# EAGLE board 50_Shot_Relay_V0.0 (EAGLE 7.6.0)
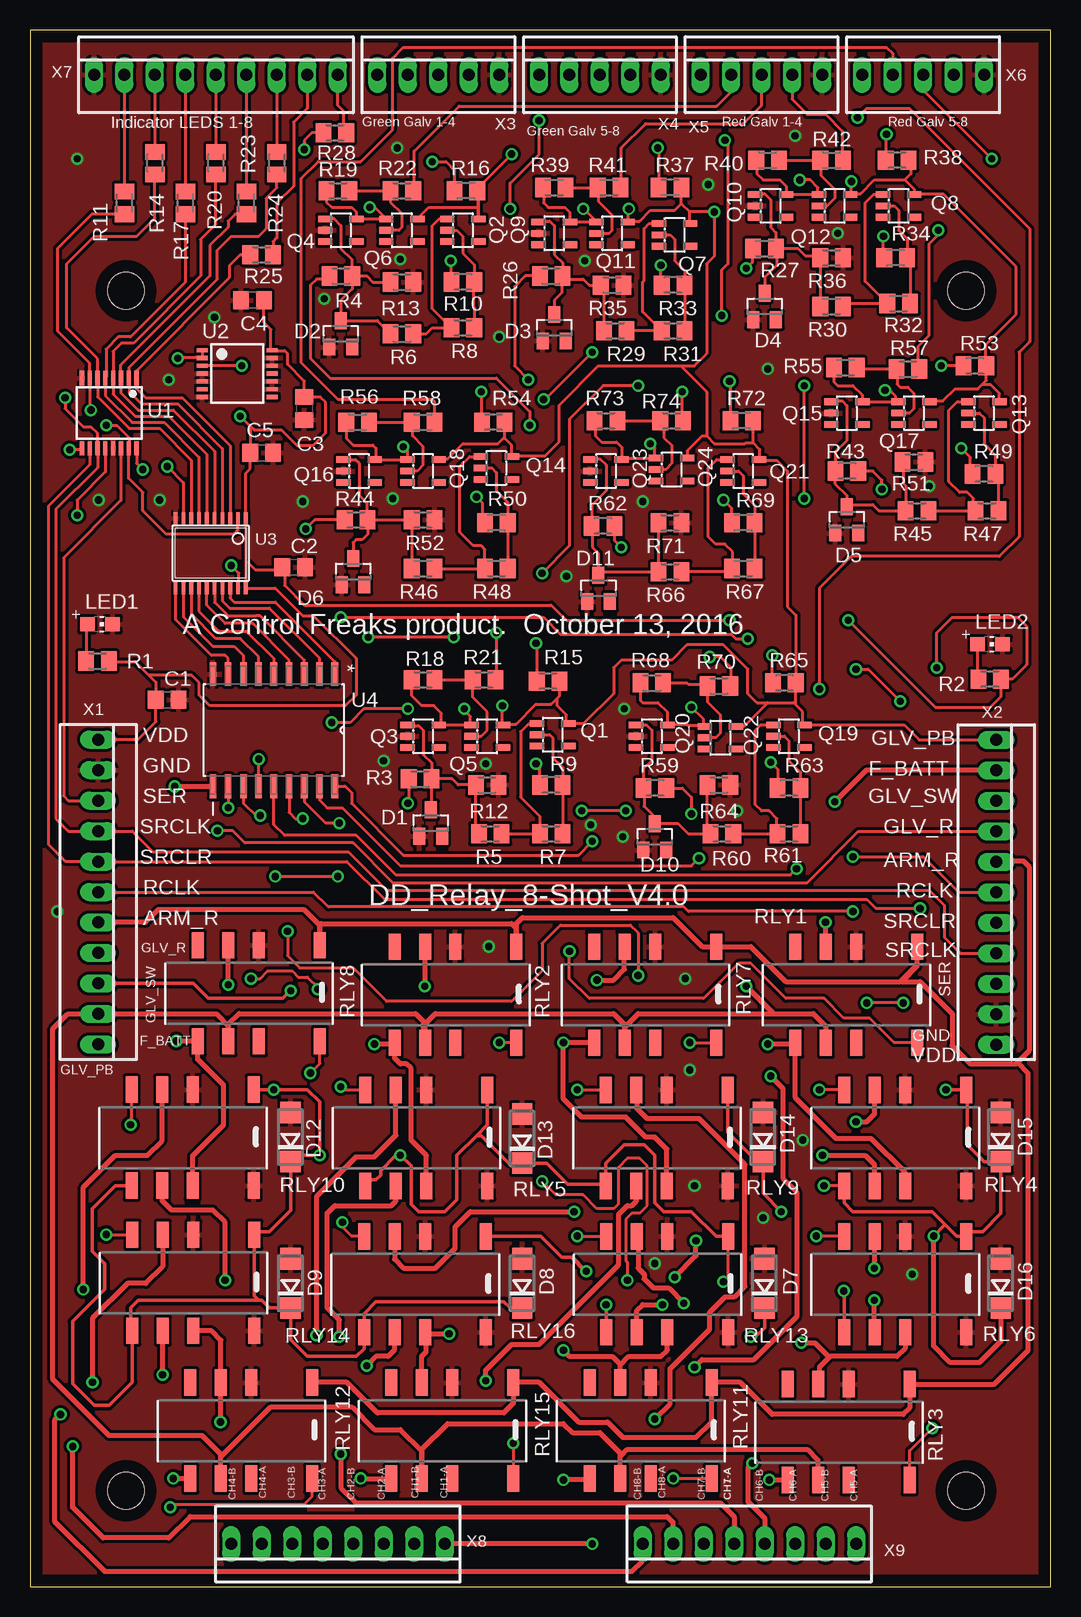
[diagram p2: board, top side]
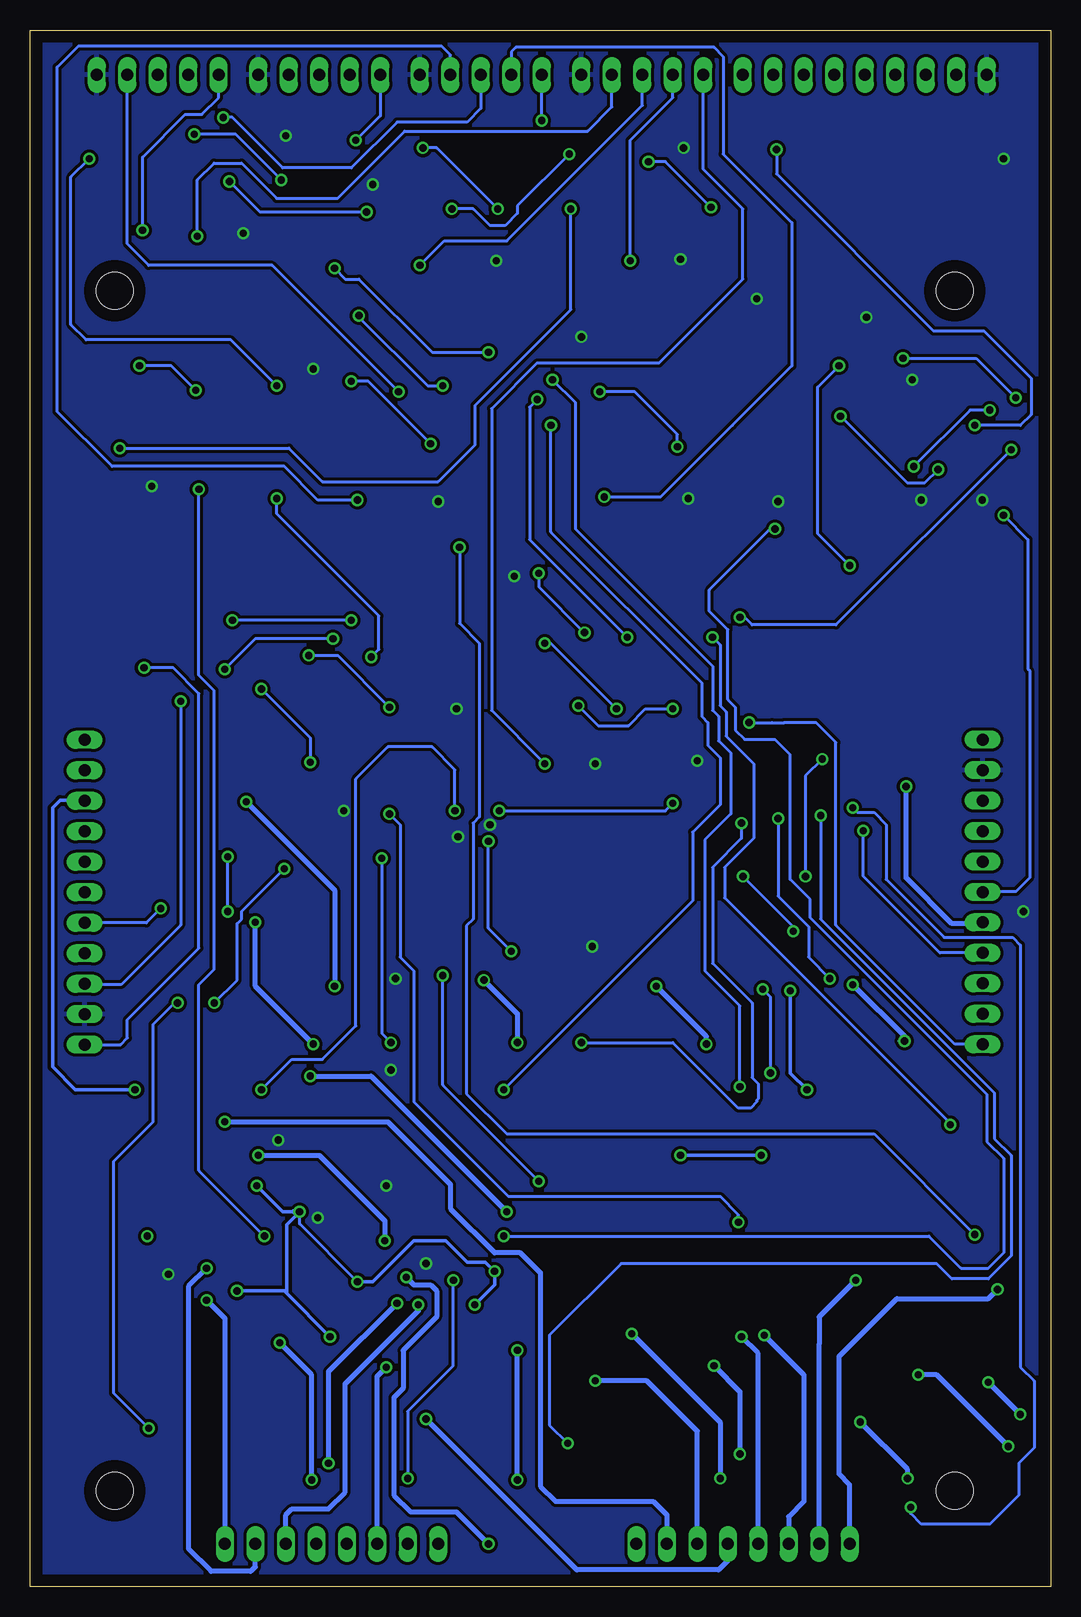
[diagram p3: board, bottom side, seen from below]

Size 85.07 x 129.72 mm. Coordinates in mm from the lower left corner, seen from the top.
Outline: 0,0 85.07,0 85.07,129.72 0,129.72 0,0
Copper layers (1*16): Top 0.035mm / dielectric 1.5mm / Bottom 0.035mm
Design rules "default *": minimum track width 10mil, minimum drill 20mil, track to track 10mil, track to pad 10mil, pad to pad 10mil, via to via 10mil, smd to smd 8mil, copper to edge 40mil, drill to drill 8mil, minimum pad ring 10mil, minimum via ring 8mil, stop-mask expansion 4mil, vias tented up to drill 0mil, thermal gap 10mil
Net classes: 0 default: width 0.254 mm, drill 0.508 mm, clearance 0.254 mm
Holes 3.05 mm at 8,108 8,8 78,8 78,108

## Footprints (pad centres in the part's own frame; a part is rotated, then mirrored left to right if it is on the bottom)
C0805 = smd 1.3 x 1.5: 1 -0.95,0; 2 0.95,0
SOT23 = smd 1 x 1.4: 1 -0.95,-1.1; 2 0.95,-1.1; 3 0,1.1
DO214AC = smd 1.8 x 1.7: A 2.05,0; C -2.05,0
CHIP-LED0805 = smd 1.2 x 1.2: A 0,-1.05; C 0,1.05
SOT23-5L = smd 0.55 x 1.2: 1 -0.95,-1.3; 2 0,-1.3; 3 0.95,-1.3; 4 0.95,1.3; 5 -0.95,1.3
M0805 = smd 1.3 x 1.6: 1 -0.95,0; 2 0.95,0
OMRONG6S = smd 1 x 2.2: 1 -3.2,-5.825; 2 1.88,-5.825; 3 4.42,-5.825; 4 6.96,-5.825; 5 6.96,2.175; 6 4.42,2.175; 7 1.88,2.175; 8 -3.2,2.175
TSSOP16 = smd 0.35 x 1.2: 1 -2.275,-2.925; 2 -1.625,-2.925; 3 -0.975,-2.925; 4 -0.325,-2.925; 5 0.325,-2.925; 6 0.975,-2.925; 7 1.625,-2.925; 8 2.275,-2.925; 9 2.275,2.925; 10 1.625,2.925; 11 0.975,2.925; 12 0.325,2.925; 13 -0.325,2.925; 14 -0.975,2.925; 15 -1.625,2.925; 16 -2.275,2.925
TSSOP14 = smd 0.35 x 0.9: 1 -1.95,-2.925; 2 -1.3,-2.925; 3 -0.65,-2.925; 4 0,-2.925; 5 0.65,-2.925; 6 1.3,-2.925; 7 1.95,-2.925; 8 1.95,2.925; 9 1.3,2.925; 10 0.65,2.925; 11 0,2.925; 12 -0.65,2.925; 13 -1.3,2.925; 14 -1.95,2.925
TSSOP20 = smd 0.305 x 0.991: 1 -2.997,-2.935; 2 -2.347,-2.935; 3 -1.697,-2.935; 4 -1.047,-2.935; 5 -0.397,-2.935; 6 0.253,-2.935; 7 0.903,-2.935; 8 1.553,-2.935; 9 2.203,-2.935; 10 2.853,-2.935; 11 2.853,2.901; 12 2.203,2.901; 13 1.553,2.901; 14 0.903,2.901; 15 0.253,2.901; 16 -0.397,2.901; 17 -1.047,2.901; 18 -1.697,2.901; 19 -2.347,2.901; 20 -2.997,2.901
SOIC127P1030X265-18N = smd 1.981 x 0.559: 1 -4.674,5.08; 2 -4.674,3.81; 3 -4.674,2.54; 4 -4.674,1.27; 5 -4.674,0; 6 -4.674,-1.27; 7 -4.674,-2.54; 8 -4.674,-3.81; 9 -4.674,-5.08; 10 4.674,-5.08; 11 4.674,-3.81; 12 4.674,-2.54; 13 4.674,-1.27; 14 4.674,0; 15 4.674,1.27; 16 4.674,2.54; 17 4.674,3.81; 18 4.674,5.08
22-23-2111 = drill 1 long: 1 -12.7,0; 2 -10.16,0; 3 -7.62,0; 4 -5.08,0; 5 -2.54,0; 6 0,0; 7 2.54,0; 8 5.08,0; 9 7.62,0; 10 10.16,0; 11 12.7,0
22-23-2051 = drill 1 long: 1 -5.08,0; 2 -2.54,0; 3 0,0; 4 2.54,0; 5 5.08,0
22-23-2091 = drill 1 long: 1 -10.16,0; 2 -7.62,0; 3 -5.08,0; 4 -2.54,0; 5 0,0; 6 2.54,0; 7 5.08,0; 8 7.62,0; 9 10.16,0
22-23-2081 = drill 1 long: 1 -8.89,0; 2 -6.35,0; 3 -3.81,0; 4 -1.27,0; 5 1.27,0; 6 3.81,0; 7 6.35,0; 8 8.89,0

## Placement (x,y rotation side)
C1  0.01uF  [C0805]  11.43,73.91 0 top
C2  0.01uF  [C0805]  21.97,84.96 0 top
C3  0.01uF  [C0805]  22.86,98.17 270 top
C4  0.01uF  [C0805]  18.54,107.19 180 top
C5  0.01uF  [C0805]  19.3,94.49 0 top
D1  5.0V  [SOT23]  33.4,63.63 0 top
D2  5.0V  [SOT23]  25.91,104.39 0 top
D3  5.0V  [SOT23]  43.69,104.9 0 top
D4  5.0V  [SOT23]  61.21,106.68 0 top
D5  5.0V  [SOT23]  68.07,88.9 0 top
D6  5.0V  [SOT23]  26.92,84.58 0 top
D7  SA2M-E3/5ATGICT-ND  [DO214AC]  61.21,25.27 90 top
D8  SA2M-E3/5ATGICT-ND  [DO214AC]  41.02,25.27 90 top
D9  SA2M-E3/5ATGICT-ND  [DO214AC]  21.72,25.27 90 top
D10  5.0V  [SOT23]  52.07,62.48 0 top
D11  5.0V  [SOT23]  47.37,83.19 0 top
D12  SA2M-E3/5ATGICT-ND  [DO214AC]  21.72,37.47 90 top
D13  SA2M-E3/5ATGICT-ND  [DO214AC]  41.02,37.34 90 top
D14  SA2M-E3/5ATGICT-ND  [DO214AC]  61.09,37.47 90 top
D15  SA2M-E3/5ATGICT-ND  [DO214AC]  80.9,37.47 90 top
D16  SA2M-E3/5ATGICT-ND  [DO214AC]  80.9,25.27 90 top
LED1  LEDCHIP-LED0805  [CHIP-LED0805]  5.83,80.2 270 top
LED2  LEDCHIP-LED0805  [CHIP-LED0805]  80,78.53 270 top
Q1  Qs5U34CT-ND  [SOT23-5L]  43.56,70.99 270 top
Q2  Qs5U34CT-ND  [SOT23-5L]  36.07,113.03 270 top
Q3  Qs5U34CT-ND  [SOT23-5L]  32.77,70.87 270 top
Q4  Qs5U34CT-ND  [SOT23-5L]  25.91,113.03 270 top
Q5  Qs5U34CT-ND  [SOT23-5L]  38.1,70.87 270 top
Q6  Qs5U34CT-ND  [SOT23-5L]  30.99,113.03 270 top
Q7  Qs5U34CT-ND  [SOT23-5L]  53.72,112.65 270 top
Q8  Qs5U34CT-ND  [SOT23-5L]  72.39,115.06 270 top
Q9  Qs5U34CT-ND  [SOT23-5L]  43.69,112.78 270 top
Q10  Qs5U34CT-ND  [SOT23-5L]  61.72,115.06 270 top
Q11  Qs5U34CT-ND  [SOT23-5L]  48.51,112.78 270 top
Q12  Qs5U34CT-ND  [SOT23-5L]  67.06,115.06 270 top
Q13  Qs5U34CT-ND  [SOT23-5L]  79.5,97.79 270 top
Q14  Qs5U34CT-ND  [SOT23-5L]  38.86,93.22 270 top
Q15  Qs5U34CT-ND  [SOT23-5L]  68.07,97.79 270 top
Q16  Qs5U34CT-ND  [SOT23-5L]  27.43,92.96 270 top
Q17  Qs5U34CT-ND  [SOT23-5L]  73.66,97.79 270 top
Q18  Qs5U34CT-ND  [SOT23-5L]  32.77,92.96 270 top
Q19  Qs5U34CT-ND  [SOT23-5L]  63.25,70.87 270 top
Q20  Qs5U34CT-ND  [SOT23-5L]  51.82,70.87 270 top
Q21  Qs5U34CT-ND  [SOT23-5L]  59.44,92.96 270 top
Q22  Qs5U34CT-ND  [SOT23-5L]  57.53,70.74 270 top
Q23  Qs5U34CT-ND  [SOT23-5L]  48.01,92.96 270 top
Q24  Qs5U34CT-ND  [SOT23-5L]  53.47,93.09 270 top
R1  100  [M0805]  5.62,77.14 180 top
R2  100  [M0805]  79.98,75.62 0 top
R3  10k  [M0805]  32.51,67.31 180 top
R4  10k  [M0805]  25.91,109.22 180 top
R5  100k  [M0805]  38.35,62.74 180 top
R6  100k  [M0805]  30.99,104.39 180 top
R7  1M  [M0805]  43.43,62.74 180 top
R8  1M  [M0805]  36.07,104.9 180 top
R9  1k  [M0805]  43.43,66.8 0 top
R10  1k  [M0805]  36.07,108.71 0 top
R11  330  [M0805]  7.87,115.32 270 top
R12  100k  [M0805]  38.1,66.8 180 top
R13  100k  [M0805]  30.99,108.71 180 top
R14  330  [M0805]  10.41,118.62 270 top
R15  10k  [M0805]  43.18,75.44 0 top
R16  10k  [M0805]  36.32,116.33 0 top
R17  330  [M0805]  12.95,115.32 270 top
R18  100k  [M0805]  32.77,75.56 180 top
R19  100k  [M0805]  25.65,116.33 180 top
R20  330  [M0805]  15.49,118.62 270 top
R21  1k  [M0805]  37.85,75.56 180 top
R22  1k  [M0805]  30.99,116.33 180 top
R23  330  [M0805]  18.03,115.32 270 top
R24  330  [M0805]  20.57,118.62 270 top
R25  330  [M0805]  19.3,111 180 top
R26  10k  [M0805]  43.43,109.22 180 top
R27  10k  [M0805]  61.21,111.51 180 top
R28  330  [M0805]  25.4,121.16 180 top
R29  100k  [M0805]  48.77,104.65 180 top
R30  100k  [M0805]  66.8,106.68 180 top
R31  1M  [M0805]  53.59,104.65 180 top
R32  1M  [M0805]  72.39,106.93 180 top
R33  1k  [M0805]  53.59,108.46 0 top
R34  1k  [M0805]  72.14,110.74 0 top
R35  100k  [M0805]  48.51,108.46 180 top
R36  100k  [M0805]  66.8,110.74 180 top
R37  10k  [M0805]  53.34,116.59 0 top
R38  10k  [M0805]  72.26,118.87 0 top
R39  100k  [M0805]  43.69,116.59 180 top
R40  100k  [M0805]  61.47,118.87 180 top
R41  1k  [M0805]  48.26,116.59 180 top
R42  1k  [M0805]  66.8,118.87 180 top
R43  10k  [M0805]  68.07,92.96 0 top
R44  10k  [M0805]  27.18,88.9 180 top
R45  100k  [M0805]  73.91,89.66 180 top
R46  100k  [M0805]  32.77,84.84 180 top
R47  1M  [M0805]  79.76,89.66 180 top
R48  1M  [M0805]  38.86,84.84 180 top
R49  1k  [M0805]  79.5,92.71 0 top
R50  1k  [M0805]  38.86,88.65 0 top
R51  100k  [M0805]  73.66,93.73 180 top
R52  100k  [M0805]  32.77,88.9 180 top
R53  10k  [M0805]  78.74,101.73 0 top
R54  10k  [M0805]  38.61,97.03 0 top
R55  100k  [M0805]  67.94,101.6 180 top
R56  100k  [M0805]  27.3,97.03 180 top
R57  1k  [M0805]  73.15,101.47 180 top
R58  1k  [M0805]  32.77,97.03 180 top
R59  10k  [M0805]  52.07,66.55 0 top
R60  100k  [M0805]  57.66,62.74 180 top
R61  1M  [M0805]  63.25,62.74 180 top
R62  10k  [M0805]  47.75,88.39 0 top
R63  1k  [M0805]  63.25,66.55 0 top
R64  100k  [M0805]  57.4,66.8 180 top
R65  10k  [M0805]  62.87,75.31 0 top
R66  100k  [M0805]  53.34,84.58 180 top
R67  1M  [M0805]  59.44,84.84 180 top
R68  100k  [M0805]  51.82,75.31 180 top
R69  1k  [M0805]  59.44,88.65 0 top
R70  1k  [M0805]  57.4,75.06 180 top
R71  100k  [M0805]  53.34,88.65 180 top
R72  10k  [M0805]  59.31,97.16 0 top
R73  100k  [M0805]  48.01,97.16 180 top
R74  1k  [M0805]  53.47,97.16 180 top
RLY1  OMRON  [OMRONG6S]  70.74,47.5 180 top
RLY2  OMRON  [OMRONG6S]  37.34,47.5 180 top
RLY3  OMRON  [OMRONG6S]  70.1,11.05 180 top
RLY4  OMRON  [OMRONG6S]  74.8,35.56 180 top
RLY5  OMRON  [OMRONG6S]  34.91,35.56 180 top
RLY6  OMRON  [OMRONG6S]  74.8,23.37 180 top
RLY7  OMRON  [OMRONG6S]  53.98,47.5 180 top
RLY8  OMRON  [OMRONG6S]  20.95,47.62 180 top
RLY9  OMRON  [OMRONG6S]  54.95,35.56 180 top
RLY10  OMRON  [OMRONG6S]  15.43,35.59 180 top
RLY11  OMRON  [OMRONG6S]  53.59,11.18 180 top
RLY12  OMRON  [OMRONG6S]  20.32,11.18 180 top
RLY13  OMRON  [OMRONG6S]  54.99,23.37 180 top
RLY14  OMRON  [OMRONG6S]  15.49,23.5 180 top
RLY15  OMRON  [OMRONG6S]  37.08,11.18 180 top
RLY16  OMRON  [OMRONG6S]  34.8,23.37 180 top
U1  MM74HC595  [TSSOP16]  6.6,97.79 180 top
U2  7400  [TSSOP14]  17.27,101.09 270 top
U3  MM74HC245  [TSSOP20]  14.99,86.11 180 top
U4  ULN2803ADW  [SOIC127P1030X265-18N]  20.32,71.37 270 top
X1  22-23-2111  [22-23-2111]  5.68,57.88 270 top
X2  22-23-2111  [22-23-2111]  80.52,57.86 270 top
X3  22-23-2051  [22-23-2051]  34.04,125.98 0 top
X4  22-23-2051  [22-23-2051]  47.5,125.98 0 top
X5  22-23-2051  [22-23-2051]  60.96,125.98 0 top
X6  22-23-2051  [22-23-2051]  74.42,125.98 0 top
X7  22-23-2091  [22-23-2091]  15.49,125.98 0 top
X8  22-23-2081  [22-23-2081]  25.65,3.56 180 top
X9  22-23-2081  [22-23-2081]  59.94,3.56 180 top

## Tracks (layer width: path | path; a pad name or v marks a point on that pad's centre or on a via)
ARM_RELAY  (via drill 0.6)
  Top 0.254: v12.06,66.67 12.09,66.7
  Top 0.406: 12.09,66.7 U4.10 | 24.13,55.12 24.16,55.09 RLY8.1 24.13,53.48 24.13,55.12 | 24.13,55.12 22.86,56.39 10.67,56.39 9.62,55.34 X1.7 | 40.51,54.86 40.51,55.24 41.02,55.75 53.59,55.75 56.02,53.32 RLY7.1 | 40.51,54.86 40.51,53.35 RLY2.1 40.54,55.02 | 57.15,53.35 RLY7.1 | RLY7.1 57.19,53.34 60.07,53.34 62.99,50.42 72.52,50.42 73.94,51.84 RLY1.1 73.91,53.3 73.91,51.69 72.64,50.42 74.17,50.42 76.83,47.75 76.83,45.09 78.36,43.56 82.17,43.56 82.3,43.69 | 82.3,43.69 83.31,44.7 83.31,59.94 82.8,60.45 80.57,60.45 X2.5 | 82.3,43.69 83.19,42.8 83.19,19.68 80.37,16.87 RLY3.1 73.3,14.88 72.77,14.35 61.85,14.35 59.18,17.02 56.81,17.02 RLY11.1 56.79,13.74 55.5,12.45 49.4,12.45 48.13,13.72 45.72,13.72 42.42,17.02 40.3,17.02 RLY15.1 40.28,15.27 39.5,14.48 28.96,14.48 26.42,17.02 23.54,17.02 RLY12.1 | 24.13,55.12 24.26,55.24 40.13,55.24 40.51,54.86
  Bottom 0.254: X1.7 5.78,55.24
  Bottom 0.406: 5.78,55.24 8.26,55.24 12.06,59.05 v12.06,66.67
CH1_A  (via drill 0.6)
  Top 0.406: v66.04,35.94 69.6,35.94 70.36,35.18 70.36,33.41 RLY4.6 | v46.86,3.56 X8.1 | v53.72,25.78 55.5,27.56 v55.5,28.83
  Bottom 0.406: v46.86,3.56 49.53,6.22 53.34,6.22 54.74,7.62 54.74,15.75 53.98,16.51 53.98,19.68 51.18,22.48 51.18,24.64 51.69,25.15 53.09,25.15 v53.72,25.78 | v66.04,35.94 60.96,35.94 55.5,30.48 v55.5,28.83
CH1_B  (via drill 0.6)
  Top 0.406: v68.83,38.73 69.72,38.73 70.38,39.4 RLY4.3
  Bottom 0.406: X8.2 32,5.97 33.15,7.11 41.27,7.11 42.55,8.38 42.55,26.16 44.2,27.81 46.35,27.81 50.04,31.5 50.04,33.53 55.24,38.73 v68.83,38.73
CH2_A  (via drill 0.6)
  Top 0.406: v37.97,17.14 37.97,18.03 40.13,20.19 42.42,20.19 49.02,26.8 49.02,30.99 49.78,31.75 50.16,31.75 50.53,32.12 RLY9.6
  Bottom 0.406: X8.3 29.46,12.95 33.66,17.14 v37.97,17.14
CH2_B  (via drill 0.6)
  Top 0.406: RLY9.3 50.55,41.37 50.55,39.88 51.44,38.99 55.75,38.99 59.56,35.18 59.56,25.02 58.67,24.13 57.91,24.13 56.64,22.86 56.64,21.46 53.34,18.16 53.34,15.24 v52.07,13.97
  Bottom 0.406: X8.4 26.92,2.16 27.69,1.4 39.5,1.4 v52.07,13.97
CH3_A  (via drill 0.6)
  Top 0.406: v25.78,20.83 25.78,22.23 24.77,23.24 24.77,31.11 25.4,31.75 30.11,31.75 30.49,32.13 RLY5.6
  Bottom 0.406: X8.5 24.38,19.43 v25.78,20.83
CH3_B  (via drill 0.6)
  Top 0.406: v23.88,20.95 23.88,32.51 27.18,35.81 28.7,35.81 30.49,37.61 RLY5.3
  Bottom 0.406: v23.88,20.95 20.57,17.65 20.57,7.11 21.84,5.84 X8.6
CH4_A  (via drill 0.6)
  Top 0.406: RLY10.6 11.01,32.17 11.81,31.37 15.24,31.37 16.26,30.35 v16.26,25.53
  Bottom 0.406: X8.7 19.3,19.43 19.3,20.19 19.3,22.48 v16.26,25.53
CH4_B  (via drill 0.6)
  Top 0.406: v4.45,24.77 4.45,33.27 7.11,35.94 9.78,35.94 11.01,37.17 RLY10.3
  Bottom 0.406: X8.8 16.76,8.51 17.65,9.4 17.65,19.18 12.83,24 5.21,24 v4.45,24.77
CH5_A  (via drill 0.6)
  Top 0.406: RLY6.6 70.36,21.22 v70.36,23.88
  Bottom 0.406: v70.36,23.88 68.83,22.35 X9.1
CH5_B  (via drill 0.6)
  Top 0.406: RLY6.3 70.36,29.17 v70.36,26.54
  Bottom 0.406: v70.36,26.54 71.88,25.02 71.88,3.17 69.98,1.27 66.67,1.27 66.29,1.65 X9.2
CH6_A  (via drill 0.6)
  Top 0.406: 50.55,21.22 RLY13.6 50.57,23.01 51.05,23.5 v52.7,23.5
  Bottom 0.406: X9.3 63.75,5.97 63.25,6.48 60.2,6.48 58.8,7.87 58.8,16.89 52.7,22.99 v52.7,23.5
CH6_B  (via drill 0.6)
  Top 0.406: RLY13.3 50.67,29.09 50.67,26.54 51.18,26.04 51.18,25.65 51.94,24.89 53.21,24.89 v54.48,23.62 | v60.2,10.29 59.82,9.91 59.82,7.11 61.21,5.71 X9.4
  Bottom 0.406: v54.48,23.62 60.2,17.91 v60.2,10.29
CH7_A  (via drill 0.6)
  Top 0.406: RLY16.6 30.35,21.17 30.35,19.68 29.84,19.18 28.83,19.18 v28.07,18.41 | v25.91,11.05 25.91,8.26 27.18,6.99 57.53,6.99 58.67,5.84 X9.5
  Bottom 0.406: v28.07,18.41 25.91,16.26 v25.91,11.05
CH7_B  (via drill 0.6)
  Top 0.406: RLY16.3 30.38,27.28 31.11,26.54 33.78,26.54 35.43,28.19 35.43,29.97 36.7,31.24 v45.34,31.24 | v61.72,42.55 62.74,41.53 62.74,34.04 63.88,32.89 63.88,22.48 60.33,18.92 56.01,18.92 v55.37,18.29
  Bottom 0.406: X9.6 56.13,17.53 v55.37,18.29 | v61.72,42.55 56.64,42.55 v45.34,31.24
CH8_A  (via drill 0.6)
  Top 0.406: X9.7 53.59,5.33 53.09,5.84 13.34,5.84 11.56,4.06 6.1,4.06 3.56,6.6 v3.56,11.68 | v11.05,17.65 11.07,17.68 RLY14.6
  Bottom 0.406: v3.56,11.68 9.53,17.65 v11.05,17.65
CH8_B  (via drill 0.6)
  Top 0.406: RLY14.3 11.05,29.3 11.05,26.67 9.65,25.27 8.13,25.27 5.21,22.35 v5.21,17.02 | v2.54,14.35 2.03,13.84 2.03,5.46 6.22,1.27 50.16,1.27 51.05,2.16 X9.8
  Bottom 0.406: v5.21,17.02 v2.54,14.35
F_BATT  (via drill 0.6)
  Top 0.406: 61.98,47.75 50.67,47.75 49.55,46.63 RLY7.6 49.55,46.84 48.64,47.75 33.78,47.75 32.92,46.89 RLY2.6 32.77,45.48 32.77,47.12 32.13,47.75 17.4,47.75 16.54,46.89 RLY8.6 16.54,46.71 15.52,47.72 X1.10 3.15,47.72 1.91,46.48 1.91,17.27 6.6,12.57 14.35,12.57 15.9,11.02 RLY12.6 15.9,10.82 20.07,14.99 26.8,14.99 28.7,13.08 30.86,13.08 32.64,11.3 32.64,9.03 RLY15.6 32.66,11.46 34.8,13.59 44.45,13.59 45.21,12.83 47.5,12.83 49.15,11.18 49.15,9.03 RLY11.6 49.17,10.82 49.78,11.43 64.77,11.43 65.66,10.54 65.66,8.9 RLY3.6 | 61.98,47.75 65.28,47.75 66.32,46.71 RLY1.6 | X2.2 69.67,68.02 v67.06,65.41 | v59.69,50.04 61.98,47.75
  Bottom 0.406: v67.06,65.41 59.69,58.04 v59.69,50.04
GLV1_GRN  (via drill 0.6)
  Top 0.254: R9.1 42.48,68.26 v42.16,68.58
  Bottom 0.254: v42.16,68.58 46.61,73.03 46.61,98.17 42.8,101.98 32.64,101.98 25.65,108.97 25.65,114.81 28.96,118.11 X3.1
GLV1_RED  (via drill 0.6)
  Top 0.254: v50.67,100.08 47.75,100.08 44.96,97.28 44.96,86.74 v42.67,84.45 | v38.86,79.5 38.86,75.63 R21.1 | v57.91,120.52 58.17,120.27 58.17,110.24 57.66,109.73 v57.66,105.92
  Bottom 0.254: X5.1 55.88,122.56 v57.91,120.52 | v50.67,100.08 51.94,100.08 57.66,105.79 v57.66,105.92 | v42.67,84.45 42.67,83.31 v38.86,79.5
GLV2_GRN  (via drill 0.6)
  Top 0.254: R10.1 35.12,110.42 v35.05,110.49
  Bottom 0.254: v35.05,110.49 35.05,120.52 31.5,124.08 X3.2
GLV2_RED
  Top 0.254: R22.1 32,116.4 32,119.63 35.75,123.38 57.21,123.38 58.42,124.59 X5.2
GLV3_GRN  (via drill 0.6)
  Top 0.254: R33.1 52.58,108.52 v52.58,110.11
  Bottom 0.254: v52.58,110.11 50.55,112.14 45.34,112.14 34.04,123.44 X3.3
GLV3_RED
  Top 0.254: R41.1 49.28,116.65 49.28,119.89 51.31,121.92 59.44,121.92 60.96,123.44 X5.3
GLV4_GRN  (via drill 0.6)
  Top 0.254: R34.1 71.12,110.74 v71.12,112.52
  Bottom 0.254: v71.12,112.52 71.12,117.22 69.72,118.62 67.44,118.62 64.52,115.7 59.44,115.7 53.85,121.28 38.61,121.28 36.58,123.32 X3.4
GLV4_RED
  Top 0.254: X5.4 63.5,123.95 64.77,122.68 66.29,122.68 67.69,121.28 67.69,118.93 R42.1
GLV5_GRN  (via drill 0.6)
  Top 0.254: R49.1 78.36,92.9 78.36,94.11 v77.6,94.87 | v40.01,114.81 40.01,116.97 42.42,119.38 v42.42,122.17
  Bottom 0.254: v40.01,114.81 40.01,106.43 48.01,98.42 48.01,95.12 51.05,92.08 60.71,92.08 63.5,94.87 v77.6,94.87 | v42.42,122.17 X4.1
GLV5_RED  (via drill 0.6)
  Top 0.254: R57.1 74.04,101.53 74.04,103.38 74.93,104.27 74.93,111.89 75.69,112.65 v75.69,113.03
  Bottom 0.254: v75.69,113.03 75.69,119.13 72.14,122.68 70.74,122.68 69.34,124.08 X6.1
GLV6_GRN  (via drill 0.6)
  Top 0.254: R50.1 37.72,88.65 37.72,90.3 v37.21,90.81
  Bottom 0.254: v37.21,90.81 32.51,90.81 27.24,96.08 26.54,96.77 21.59,101.73 21.59,113.67 27.3,119.38 27.3,127.51 28.07,128.27 44.58,128.27 44.96,127.89 X4.2
GLV6_RED
  Top 0.254: R58.1 33.72,98.75 33.53,98.93 25.65,98.93 22.61,101.98 22.61,117.35 24,118.75 27.56,118.75 30.23,121.41 30.23,127.38 31.11,128.27 71.37,128.27 71.88,127.76 X6.2
GLV7_GRN  (via drill 0.6)
  Top 0.254: v68.96,122.43 69.72,123.19 73.28,123.19 83.31,113.16 83.31,103.76 82.42,102.87 82.42,87.5 80.77,85.85 68.45,85.85 65.79,83.19 v65.79,74.8 | v61.72,68.71 62.3,68.13 R63.1
  Bottom 0.254: X4.3 47.5,123.19 48.64,122.05 54.48,122.05 58.29,118.24 64.01,118.24 68.2,122.43 v68.96,122.43 | v65.79,74.8 61.72,70.74 v61.72,68.71
GLV7_RED  (via drill 0.6)
  Top 0.254: R70.1 58.42,75.12 58.42,76.58 57.53,77.47 v56.64,77.47 | v64.52,90.68 v64.52,100.08 | v80.14,119 74.42,124.71 X6.3
  Bottom 0.254: v56.64,77.47 56.01,78.11 56.01,80.9 64.52,89.41 v64.52,90.68 | v64.52,100.08 68.33,103.89 80.39,103.89 81.66,105.16 81.66,117.47 v80.14,119
GLV8_GRN  (via drill 0.6)
  Top 0.254: R69.1 58.49,89.85 v57.78,90.55
  Bottom 0.254: v57.78,90.55 61.09,90.55 63.88,93.34 78.23,93.34 82.8,97.92 82.8,106.43 82.8,107.06 82.8,126.62 81.03,128.4 50.8,128.4 50.04,127.64 X4.4
GLV8_RED  (via drill 0.6)
  Top 0.254: R74.1 54.36,97.22 v54.36,99.57
  Bottom 0.254: v54.36,99.57 64.9,110.11 75.18,110.11 76.96,111.89 X6.4
GLV_1  (via drill 0.6)
  Top 0.254: RLY4.4 67.83,41.4 v65.79,41.4 | v49.66,64.64 v45.97,64.64 | R3.2 31.56,65.34 v31.5,65.28
  Bottom 0.254: v65.79,41.4 63.25,43.94 60.71,43.94 57.91,46.74 57.91,67.31 55.24,69.98 51.56,69.98 49.66,68.07 v49.66,64.64 | v45.97,64.64 32.13,64.64 v31.5,65.28
GLV_2  (via drill 0.6)
  Top 0.254: R4.2 24.7,108.97 23.88,108.97 23.37,108.46 23.37,102.36 25.02,100.71 38.86,100.71 41.66,97.92 v41.66,96.77 | v45.59,41.4 47.97,41.4 RLY9.4
  Bottom 0.254: v45.59,41.4 29.84,57.15 29.84,62.87 27.56,65.15 27.56,69.09 28.57,70.1 28.57,72.01 29.08,72.52 29.08,75.31 41.66,87.88 v41.66,96.77
GLV_3  (via drill 0.6)
  Top 0.254: R26.2 41.27,109.22 40.39,108.33 40.39,101.73 v41.53,100.58 | v25.91,41.66 26.18,41.38 RLY5.4
  Bottom 0.254: v41.53,100.58 39.62,98.68 39.62,88.14 28.19,76.71 28.19,73.03 27.69,72.52 27.69,70.48 26.67,69.47 26.67,64.39 28.83,62.23 28.83,51.31 25.91,48.39 v25.91,41.66
GLV_4  (via drill 0.6)
  Top 0.254: R27.2 60.2,111.44 60.2,110.36 v59.69,109.86 | v46.86,102.87 42.93,98.93 v42.8,98.93 | v35.31,79.12 v28.19,79.12 | v8.38,38.48 8.47,38.57 RLY10.4
  Bottom 0.254: v59.69,109.86 58.8,108.97 57.66,108.97 51.56,102.87 v46.86,102.87 | v42.8,98.93 43.43,98.3 43.43,87.25 v35.31,79.12 | v8.38,38.48 8.38,38.61 27.18,57.4 27.18,59.94 24.77,62.36 24.77,68.58 27.05,70.87 27.05,72.9 27.56,73.41 27.56,78.49 v28.19,79.12
GLV_5  (via drill 0.6)
  Top 0.254: v70.99,91.44 70.99,92.2 70.23,92.96 R43.2 | RLY6.4 65.55,29.19 v65.53,29.21
  Bottom 0.254: v65.53,29.21 70.99,34.67 70.99,50.16 69.72,51.44 69.72,74.68 70.99,75.95 v70.99,91.44
GLV_6  (via drill 0.6)
  Top 0.254: R44.2 23.75,88.9 v22.99,88.14 | v45.59,29.21 48.01,29.21 RLY13.4
  Bottom 0.254: v22.99,88.14 23.37,88.14 28.45,83.06 28.45,81.28 26.92,79.76 26.92,73.91 26.29,73.28 26.29,71.37 25.53,70.61 22.99,70.61 21.72,69.34 21.72,58.93 20.07,57.28 20.07,55.75 5.33,41.02 5.33,37.08 3.94,35.69 3.94,27.81 5.21,26.54 7.49,26.54 10.16,29.21 v45.59,29.21
GLV_7  (via drill 0.6)
  Top 0.254: R59.2 54.36,66.55 55.12,65.79 v55.12,64.39 | RLY16.4 26.81,29.19 26.04,29.97 v26.04,30.35
  Bottom 0.254: v55.12,64.39 54.23,63.5 54.23,52.45 53.09,51.31 53.09,40.39 45.21,32.51 27.56,32.51 26.04,30.99 v26.04,30.35
GLV_8  (via drill 0.6)
  Top 0.254: R62.2 48.7,87.19 v49.28,86.61 | v6.35,29.34 8.52,29.34 RLY14.4
  Bottom 0.254: v6.35,29.34 14.73,37.72 45.34,37.72 48.7,41.08 48.7,55.05 48.13,55.63 48.13,63.63 47.62,64.14 47.62,78.61 49.28,80.26 v49.28,86.61
GLV_PB  (via drill 0.6)
  Top 0.254: R16.2 37.37,116.24 37.37,114.94 | 37.37,114.94 Q2.5 37.34,114.01 37.34,116.59 v40.13,119.38 | Q6.5 33.24,114.94 37.37,114.94 | 54.29,115.25 R37.2 | Q7.5 54.99,113.63 54.99,114.55 | 54.3,115.25 54.29,115.25 | 54.29,115.25 53.72,114.68 51.69,114.68 50.8,113.79 49.88,113.79 Q11.5 49.81,114.71 v49.91,114.81 | 54.29,115.25 54.99,114.55 | 72.9,117.22 70.36,117.22 69.22,116.08 68.42,116.08 Q12.5 68.45,116.11 v68.45,117.09 | 72.9,117.22 73.69,116.43 Q8.5 76.14,116.01 82.17,109.98 82.17,106.05 79.63,103.5 79.63,101.41 R53.2 79.69,100.52 79.31,100.14 | R38.2 73.41,118.68 73.41,117.73 72.9,117.22 | 54.99,114.55 v57.02,114.55 57.02,110.87 56.39,110.24 56.39,102.74 55.37,101.73 54.23,101.73 | 39.56,95.7 40.13,95.12 40.13,94.2 Q14.5 40.23,94.23 42.93,94.23 44.07,95.38 44.07,98.42 47.37,101.73 54.23,101.73 | 39.56,95.7 R54.2 | Q18.5 34.13,93.98 34.8,93.98 36.07,95.25 38.99,95.25 39.44,95.7 39.56,95.7 | Q17.5 75.03,98.81 76.07,98.81 77.09,99.82 78.99,99.82 79.31,100.14 | Q13.5 80.77,98.77 80.77,99.44 80.07,100.14 79.31,100.14 | 56.39,95.89 56.39,99.57 54.23,101.73 | Q24.5 54.77,94.64 56.01,95.89 56.39,95.89 | 60.26,95.32 60.83,94.74 60.83,94.01 Q21.5 60.8,93.85 62.23,93.85 63.12,92.96 63.12,81.66 63.81,80.97 R65.2 63.81,73.47 | 60.26,95.32 R72.2 | 56.39,95.89 57.02,95.25 59.56,95.25 59.63,95.32 60.26,95.32 | 43.94,74.04 43.43,73.53 42.16,73.53 40.51,71.88 39.47,71.88 Q5.5 39.37,71.85 v39.37,73.41 | 43.94,74.04 44.13,74.23 R15.2 | 43.94,74.04 43.94,73.41 44.7,72.64 44.7,72.1 Q1.5 46.16,71.94 48.64,74.42 48.64,76.58 49.28,77.22 53.47,77.22 54.74,78.49 57.78,78.49 59.82,76.45 59.82,74.42 60.58,73.66 61.47,73.66
  Top 0.254: 63.81,73.47 64.39,72.9 64.39,71.97 Q19.5 72.84,71.82 74.09,70.56 X2.1 | 61.47,73.66 63.63,73.66 63.81,73.47 | Q22.5 58.9,71.75 59.56,71.75 61.47,73.66 | v31.5,73.15 27.81,73.15 26.67,72.01 v25.15,72.01
  Bottom 0.254: v40.13,119.38 44.45,115.06 44.45,114.43 45.47,113.41 46.74,113.41 48.13,114.81 v49.91,114.81 | v68.45,117.09 65.91,114.55 v57.02,114.55 | v39.37,73.41 37.72,71.75 35.18,71.75 33.78,73.15 v31.5,73.15 | v25.15,72.01 23.24,72.01 22.23,72.01 19.56,72.01 17.91,70.36 17.91,55.12 8,45.21 5.71,45.21 X1.11
GLV_RELAY  (via drill 0.6)
  Top 0.254: X2.4 69.03,62.94 64.77,58.67 30.23,58.67 26.92,61.98 17.91,61.98 16.89,62.99 v15.62,62.99
  Bottom 0.254: X1.8 9.24,52.8 15.62,59.18 v15.62,62.99
GLV_SW  (via drill 0.6)
  Top 0.254: RLY13.1 58.19,25.81 v57.78,25.4 | 67.83,33.4 v66.17,33.4
  Top 0.305: X1.9 13.62,50.26 14.86,49.02 21.08,49.02 v21.72,49.66 | RLY10.1 v20.32,41.4 23.11,41.4 24.13,40.39 v24.13,35.94 21.72,35.94 D12.C 21.72,31.37 19.94,29.59 18.96,29.59 RLY14.1 18.69,24.23 19.05,23.88 | RLY5.5 28.48,33.91 28.83,33.91 29.21,34.29 29.21,34.67 30.48,35.94 v30.86,35.94 31.75,35.05 31.75,31.88 32.38,31.24 34.54,31.24 35.56,32.26 35.56,35.94 37.21,37.59 | 19.05,23.88 9.02,23.88 8.38,23.24 8.38,21.47 RLY14.5 8.53,17.04 6.6,15.11 5.33,15.11 3.56,16.89 3.56,22.1 6.22,24.77 6.22,26.92 5.21,27.94 5.21,31.5 7.12,33.41 RLY10.5 | 19.05,23.88 19.3,23.88 19.94,23.24 21.7,23.24 D9.C 21.72,20.57 23.11,19.18 27.18,19.18 27.84,19.84 RLY16.5 27.84,22.76 28.83,23.75 39.5,23.75 40.02,23.22 D8.C | RLY5.1 38.11,38.49 38.1,38.48 | 37.21,37.59 37.59,37.59 39.9,35.29 D13.C 43.07,35.29 44.83,33.53 47.85,33.53 RLY9.5 47.99,35.29 49.53,36.83 51.18,36.83 52.07,35.94 52.07,32 52.83,31.24 55.12,31.24 57.17,29.19 RLY13.1 58.17,29.17 | RLY9.1 58.17,41.37 58.17,37.85 60.45,35.56 60.94,35.56 D14.C 61.09,32.77 v62.61,31.24 | 67.83,33.4 RLY4.5 67.84,31.98 68.58,31.24 75.18,31.24 76.2,30.23 | 76.2,30.23 77.23,29.19 RLY6.1 78.4,29.59 79.38,29.59 80.9,31.11 D15.C 79.52,35.41 78.11,36.83 78.11,41.28 RLY4.1 76.34,41.38 v76.33,41.4 | D7.C 61.21,21.59 60.45,20.83 v60.07,20.83 | v67.82,24.64 67.84,24.61 RLY6.5 | RLY13.5 48.01,21.22 v48.01,23.5 | 45.09,27.43 45.21,27.43 v46.35,26.29 46.23,26.29 45.09,27.43 | 42.56,29.19 44.32,27.43 45.09,27.43 | 42.56,29.19 RLY16.1 38.02,29.21 42.55,29.21 42.56,29.19 | 37.21,37.59 38.1,38.48 | 38.1,38.48 38.1,41.66 38.23,41.78 | v75.31,29.21 76.2,30.1 76.2,30.23
  Top 0.406: D16.C 80.9,20.45 79.12,18.67 76.71,18.67 75.31,20.07 v75.31,29.21
  Bottom 0.254: v57.78,25.4 62.61,30.23 v62.61,31.24
  Bottom 0.305: v21.72,49.66 21.72,42.8 v20.32,41.4 | v30.86,35.94 v24.13,35.94 | v66.17,33.4 64.01,31.24 v62.61,31.24 63.69,30.16 63.69,24.45 | v76.33,41.4 81.28,41.4 83.19,43.31 83.19,64.9 82.55,65.53 80.57,65.53 X2.3 | v60.07,20.83 63.69,24.45 | 63.69,24.45 63.88,24.64 v67.82,24.64 | v48.01,23.5 46.35,25.15 v46.35,26.29 47.12,27.05 48.64,27.05 50.42,28.83 53.09,28.83 56.52,25.4 v57.78,25.4
  Bottom 0.406: 63.12,31.24 v62.61,31.24
GND  (via drill 0.6)
  other vias: 3.94,119 30.86,110.62 30.23,90.68 46.23,110.49 67.31,112.78 74.93,91.69 37.97,68.58 58.93,64.64 15.37,105.79 51.05,90.42 56.52,116.84 11.56,100.58 22.73,90.42 39.12,104.14 30.61,119.89 61.47,101.47 10.79,90.55 44.7,84.2 55.37,33.4 24.51,107.31 63.75,120.9 38.23,53.34 54.61,50.67 2.29,56.26 49.4,62.48 49.53,73.15 29.46,68.83 46.74,63.5 61.09,30.73 54.99,43.05 52.07,26.92 64.39,37.21 5.71,90.55 73.53,26.04
  pour Top: -0.25,130.05 85.6,130.05 85.6,-0.25 -0.25,-0.25
  pour Bottom: 0.38,129.54 85.09,129.54 85.09,0.38 0.25,0.38 0.25,129.54
N$1
  Top 0.254: LED2.A 78.95,75.7 R2.1
N$2
  Top 0.254: X7.4 R17.1
N$3
  Top 0.254: X7.3 R14.1
N$4
  Top 0.254: LED1.A 4.67,80.09 R1.2
N$5
  Top 0.254: X7.2 R11.1
N$6  (via drill 0.6)
  Top 0.406: RLY4.7 72.92,34.52 70.1,37.34 67.18,37.34 63.78,40.74 RLY1.5 63.67,45.21 v61.47,45.21 | RLY1.3 66.32,55.35 v66.29,55.37
  Bottom 0.406: v61.47,45.21 66.29,50.04 v66.29,55.37
N$9  (via drill 0.6)
  Top 0.254: U3.2 17.33,88.07 17.02,87.76 11.3,87.76 9.4,89.66 9.4,91.19 8.23,92.36 U1.15 8.26,94.89 8.26,95.76 7.24,96.77 v6.35,96.77 | R28.2 23.5,121.16 22.86,120.52 v22.86,119.76
  Bottom 0.254: v6.35,96.77 2.54,96.77 1.65,97.66 1.65,100.71 5.59,104.65 9.78,104.65 22.86,117.73 v22.86,119.76
N$10
  Top 0.254: R25.2 17.53,111 16.64,110.11 16.64,109.09 8.88,101.33 U1.1 8.89,100.7 8.89,99.82 9.65,99.06 12.7,99.06 16.68,95.08 U3.3
N$11
  Top 0.254: U3.4 16.03,94.84 12.32,98.55 9.27,98.55 8.26,99.57 8.26,100.69 U1.2 8.26,100.74 8.26,101.6 15.62,108.97 15.62,111.38 16.76,112.52 19.05,112.52 19.68,113.16 19.68,115.7 20.57,116.59 R24.2
N$12
  Top 0.254: R23.2 17.08,114.37 16.51,113.79 16.51,113.28 14.99,111.76 14.99,109.22 7.58,101.81 U1.3 7.58,99.48 9.02,98.04 11.94,98.04 15.38,94.6 U3.5
N$13
  Top 0.254: U3.6 14.73,94.36 11.56,97.54 8.76,97.54 6.93,99.37 U1.4 6.93,102.94 7.62,103.63 8.64,103.63 14.22,109.22 14.22,112.27 15.49,113.54 R20.2
N$14
  Top 0.254: R17.2 12.95,108.71 8.38,104.14 7.37,104.14 6.35,103.12 6.35,100.79 U1.5 6.28,99.26 8.51,97.03 11.18,97.03 14.08,94.12 U3.7
N$15
  Top 0.254: U3.8 13.43,93.88 10.79,96.52 8.26,96.52 5.63,99.15 U1.6 5.63,102.32 3.05,104.9 3.05,110.24 5.33,112.52 8.89,112.52 10.41,114.05 R14.2
N$16  (via drill 0.6)
  Top 0.254: R11.2 5.15,114.37 2.29,111.51 2.29,104.65 4.98,101.95 U1.7 4.98,98.14 v5.08,98.04 | v11.43,93.34 12.78,91.99 U3.9
  Bottom 0.254: v5.08,98.04 6.73,98.04 v11.43,93.34
N$17
  Top 0.254: U3.18 16.68,82.38 17.02,82.04 20.45,82.04 25.4,77.09 U4.1
N$18  (via drill 0.6)
  Top 0.254: U3.19 17.4,83.27 17.4,84.45 v16.76,85.09 | v17.65,101.73 14.36,101.73 U2.3
  Bottom 0.254: v16.76,85.09 19.43,87.76 19.43,99.95 v17.65,101.73
N$28
  Top 0.254: U3.17 16.03,82.14 16.64,81.53 19.94,81.53 24.13,77.34 U4.2
N$29
  Top 0.254: U3.16 15.38,82.03 16.51,80.9 18.29,80.9 18.8,80.9 19.18,80.9 22.86,77.22 U4.3
N$30
  Top 0.254: U4.4 21.59,77.22 18.54,80.26 16.26,80.26 14.73,81.79 U3.15
N$31
  Top 0.254: U3.14 14.08,81.29 15.75,79.63 18.03,79.63 20.32,77.34 U4.5
N$32
  Top 0.254: U4.6 19.05,77.47 17.53,78.99 15.49,78.99 13.46,81.03 13.46,83.18 U3.13
N$33
  Top 0.254: U3.12 12.78,80.82 15.24,78.36 17.02,78.36 17.78,77.6 U4.7
N$34
  Top 0.254: U4.8 16.51,77.34 16.26,77.6 15.11,77.6 12.13,80.58 U3.11
N$43  (via drill 0.6)
  Top 0.254: U4.18 26.26,66.7 26.8,66.17 26.8,65.28 31.11,60.96 45.72,60.96 v46.86,62.1 | RLY1.8 72.15,45.32 72.14,45.34 72.01,45.34 69.98,47.37 67.82,47.37 66.17,49.02 62.99,49.02 60.07,51.94 59.05,51.94 56.13,49.02 46.61,49.02 44.96,50.67 v44.96,52.96
  Bottom 0.254: v44.96,52.96 46.86,54.86 v46.86,62.1
N$45  (via drill 0.6)
  Top 0.254: U4.17 24.13,65.53 24.77,64.9 26.04,64.9 30.86,60.07 55.12,60.07 v55.75,60.71 | v54.99,45.34 57.16,45.34 RLY7.8
  Bottom 0.254: v55.75,60.71 55.75,46.1 v54.99,45.34
N$46  (via drill 0.6)
  Top 0.254: U4.16 22.86,65.41 24.64,63.63 v25.78,63.63 | RLY2.8 39.13,45.32 v39.12,45.34
  Bottom 0.254: v39.12,45.34 31.5,45.34 26.04,39.88 25.02,39.88 24.51,40.39 24.51,40.51 24.38,40.64 24.38,41.91 24.89,42.42 24.89,48.64 28.19,51.94 28.19,59.94 25.78,62.36 v25.78,63.63
N$47  (via drill 0.6)
  Top 0.254: U4.15 21.59,64.52 22.1,64.01 v22.73,64.01 | v18.41,50.67 19.18,50.67 19.81,51.31 21.84,51.31 22.35,50.8 23.11,50.8 24,49.91 v24,49.78 | v23.37,42.8 24.16,43.59 RLY8.8
  Bottom 0.254: v22.73,64.01 22.73,57.53 20.19,54.99 20.19,52.45 v18.41,50.67 | v24,49.78 23.37,49.15 v23.37,42.8
N$48  (via drill 0.6)
  Top 0.254: RLY3.8 73.3,11.33 v75.18,13.21 | v72.77,48.64 v69.72,48.64 | U4.14 20.32,63.5 21.21,62.61 27.18,62.61 30.48,59.31 63.37,59.31 v63.88,59.82
  Bottom 0.254: v72.77,48.64 73.03,48.64 74.8,46.86 74.8,38.73 78.11,35.43 78.11,16.13 v75.18,13.21 | v69.72,48.64 67.82,50.55 67.82,55.24 67.44,55.63 67.44,56.26 v63.88,59.82
N$49  (via drill 0.6)
  Top 0.254: v49.78,25.53 49.78,27.05 49.66,27.18 49.66,30.61 50.16,31.11 50.8,31.11 51.44,31.75 51.44,35.05 50.8,35.69 49.78,35.69 49.02,34.92 49.02,31.88 48.64,31.5 47.24,31.5 46.1,32.64 43.81,32.64 v42.67,33.78 | U4.13 v19.05,68.96 | v20.45,59.18 v25.65,59.18 | v21.46,54.61 21.46,52.58 22.48,51.56 26.92,51.56 29.72,48.77 40.13,48.77 42.67,51.31 42.67,53.59 44.2,55.12 50.04,55.12 50.67,54.48 v50.67,50.93 | RLY11.8 53.61,9 v53.59,9.02
  Bottom 0.254: v19.05,68.96 20.45,67.56 v20.45,59.18 | v25.65,59.18 21.46,54.99 v21.46,54.61 | v50.67,50.93 50.67,41.78 v42.67,33.78 | v49.78,25.53 49.85,25.46 49.85,18.35 53.59,14.61 v53.59,9.02
N$50  (via drill 0.6)
  Top 0.254: U4.12 17.78,65.28 18.8,64.26 v19.18,64.26 | v40.26,11.94 40.28,11.91 RLY15.8
  Bottom 0.254: v19.18,64.26 19.18,55.63 4.7,41.15 4.7,37.34 3.3,35.94 3.3,27.56 5.21,25.65 8.26,25.65 9.53,26.92 35.81,26.92 41.78,20.95 41.78,13.46 v40.26,11.94
N$51  (via drill 0.6)
  Top 0.254: U4.11 v16.51,64.9 | v11.68,6.6 11.94,6.86 22.86,6.86 23.52,7.52 RLY12.8
  Bottom 0.254: v16.51,64.9 16.13,64.52 14.73,64.52 13.72,63.5 13.72,58.93 8.89,54.1 3.17,54.1 2.54,53.47 2.54,18.29 1.4,17.14 1.4,11.56 2.67,10.29 2.67,7.62 5.08,5.21 10.79,5.21 11.68,6.1 v11.68,6.6
N$63  (via drill 0.6)
  Top 0.406: RLY5.7 33.03,35.93 31.75,37.21 31.75,43.18 31.37,43.56 30.86,43.56 30.38,44.04 RLY2.5 30.27,45.21 v28.7,45.21 | v32.89,50.04 32.92,50.06 RLY2.3
  Bottom 0.406: v28.7,45.21 28.7,45.85 v32.89,50.04
N$68  (via drill 0.6)
  Top 0.406: RLY9.7 53.07,36.46 52.07,37.47 51.31,37.47 49.66,39.12 45.97,39.12 44.45,40.64 v44.45,45.34 44.47,45.32 RLY7.5 | RLY7.3 49.53,53.3 49.53,51.44 48.64,50.55 v47.24,50.55
  Bottom 0.406: v47.24,50.55 44.45,47.75 v44.45,45.34
N$71  (via drill 0.6)
  Top 0.406: RLY6.7 72.92,19.84 72.26,19.18 66.67,19.18 66.61,19.11 | 66.61,19.11 65.79,18.29 65.79,16.98 RLY3.3 | RLY3.5 61.61,8.87 v61.59,8.89 | v64.26,20.32 65.41,20.32 66.61,19.11
  Bottom 0.406: v61.59,8.89 61.59,17.65 v64.26,20.32
N$75  (via drill 0.6)
  Top 0.406: RLY10.7 13.55,35.9 16.13,38.48 16.13,41.78 13.97,43.94 13.97,45.42 RLY8.5 12.21,45.45 v12.19,45.47 | 16.51,53.42 RLY8.3 16.54,50.19 v16.51,50.16
  Bottom 0.406: 12.57,45.47 v12.19,45.47 12.19,45.85 v16.51,50.16
N$80  (via drill 0.6)
  Top 0.406: RLY11.3 49.17,17.91 49.17,18.39 | 49.17,18.39 49.15,18.41 49.91,19.18 52.58,19.18 53.11,19.71 RLY13.7 | RLY11.5 46.52,8.89 v44.45,8.89 | v44.45,19.68 44.96,19.18 48.51,19.18 49.17,18.52 49.17,18.39
  Bottom 0.406: v44.45,8.89 v44.45,19.68
N$87  (via drill 0.6)
  Top 0.406: RLY12.5 11.95,9 v11.94,9.02 | v15.88,13.72 15.88,16.98 RLY12.3 15.9,20.55 15.13,21.32 RLY14.7
  Bottom 0.406: v11.94,9.02 11.94,9.78 v15.88,13.72
N$94  (via drill 0.6)
  Top 0.406: RLY16.7 33.02,21.09 33.02,20.95 | RLY15.3 32.66,19.2 33.02,19.56 33.02,20.95 | 33.02,20.95 33.15,21.08 v34.92,21.08 | v27.56,9.02 27.57,9 RLY15.5
  Bottom 0.406: v34.92,21.08 27.56,13.72 v27.56,9.02
N$106
  Top 0.254: Q3.1 31.53,71.75 32.38,71.75 32.77,71.37 32.77,69.34 33.46,68.65 R3.1 | R3.1 33.46,64.79 D1.3 | R5.2 37.15,62.99 R12.2 35.69,66.8 35.18,67.31 R3.1
N$107
  Top 0.254: R5.1 R7.2 42.48,64.2 40.89,65.79 40.89,71.25 41.53,71.88 42.2,71.88 Q1.1
N$108
  Top 0.254: R18.1 R21.2 36.9,74.1 38.1,72.9 38.1,71.37 37.59,70.87 Q5.2
N$109
  Top 0.254: R7.1 44.45,62.8 44.45,66.17 44.38,66.23 R9.2 44.38,68.27 43.56,69.09 43.56,70.74 43.31,70.99 Q1.2
N$110  (via drill 0.6)
  Top 0.254: Q3.5 34.29,72.04 | 34.29,72.04 34.29,72.77 33.66,73.41 32.64,73.41 31.82,74.23 R18.2 | v36.2,73.15 36.2,73.03 36.7,72.52 36.7,71.91 Q5.1 34.36,71.82 34.29,71.88 34.29,72.04 | v42.16,78.61 42.23,78.55 R15.1
  Bottom 0.254: v36.2,73.15 41.66,78.61 v42.16,78.61
N$114
  Top 0.254: R4.1 26.86,108.14 25.91,107.19 D2.3 28.94,105.49 R6.2 | R4.1 28.07,109.22 28.57,108.71 R13.2 | Q4.1 25.34,113.98 25.91,113.41 25.91,111.51 26.8,110.62 26.8,109.28 R4.1
N$115
  Top 0.254: R6.1 33.02,104.39 33.53,104.9 R8.2 33.53,106.49 33.53,113.41 34.1,113.98 Q2.1
N$116
  Top 0.254: Q2.2 35.56,113.03 36.07,112.52 36.07,111.12 37.02,110.17 R10.2 36.96,108.65 36.96,106.68 37.02,106.62 R8.1
N$117  (via drill 0.6)
  Top 0.254: R19.2 24.7,115.38 25.15,114.94 26.8,114.94 27.18,114.55 27.18,114.01 Q4.5 Q6.1 28.73,114.94 v28.32,114.94 | v33.53,118.75 34.67,118.75 35.37,118.04 R16.1
  Bottom 0.254: v28.32,114.94 32.13,118.75 v33.53,118.75
N$118
  Top 0.254: R19.1 R22.2 30.04,115.38 30.99,114.43 30.99,113.28 30.73,113.03 Q6.2
N$120
  Top 0.254: Q9.1 42.45,113.79 43.31,113.79 43.69,113.41 43.69,111 44.38,110.3 R26.1 | R26.1 44.32,109.16 44.32,107.82 43.69,107.19 D3.3 | R26.1 44.64,108.97 46.1,108.97 46.61,108.46 R35.2 47.82,108.2 R29.2
N$121
  Top 0.254: R29.1 R31.2 51.05,106.24 51.05,108.71 51.18,108.84 51.18,113.16 51.62,113.6 Q7.1
N$122
  Top 0.254: R31.1 R33.2 54.54,109.67 53.72,110.49 53.72,112.27 53.34,112.65 Q7.2
N$123  (via drill 0.6)
  Top 0.254: R39.2 42.8,116.53 42.8,115.32 43.18,114.94 44.58,114.94 44.99,114.52 Q9.5 Q11.1 46.13,114.81 v46.1,114.81 | v52.32,119.89 52.39,119.82 R37.1
  Bottom 0.254: v46.1,114.81 51.18,119.89 v52.32,119.89
N$124
  Top 0.254: Q11.2 48.26,112.78 48.51,113.03 48.51,114.3 47.37,115.44 47.37,116.53 R41.2 R39.1
N$127
  Top 0.254: Q10.1 60.49,116.08 61.21,116.08 61.72,115.57 61.72,113.28 62.16,112.84 R27.1 | R27.1 62.23,111.44 62.23,110.11 61.21,109.09 D4.3 | R27.1 64.01,111.51 64.64,110.87 65.72,110.87 R36.2 R30.2
N$128
  Top 0.254: Q8.1 70.29,116.01 69.6,115.32 69.6,108.78 R32.2 68.01,106.93 R30.1
N$129
  Top 0.254: R32.1 73.34,110.49 R34.2 73.09,112.33 72.39,113.03 72.39,114.68 72.01,115.06 Q8.2
N$130  (via drill 0.6)
  Top 0.254: R40.2 60.58,118.81 60.58,117.73 61.09,117.22 62.48,117.22 63.02,116.68 Q10.5 Q12.1 65.66,116.11 65.66,116.59 65.02,117.22 v64.14,117.22 | v71.37,121.03 71.31,120.97 R38.1
  Bottom 0.254: v64.14,117.22 67.94,121.03 v71.37,121.03
N$131
  Top 0.254: R40.1 R42.2 65.91,118.81 65.91,117.6 67.06,116.46 67.06,115.7 66.42,115.06 Q12.2
N$134
  Top 0.254: Q20.1 51.37,71.82 51.82,71.37 51.82,68.83 51.12,68.14 R59.1 51.18,66.49 51.18,65.02 52.07,64.14 D10.3 | D10.3 52.11,63.25 | R64.2 56.45,62.99 R60.2 54.86,62.74 54.02,63.58 D10.3
N$135
  Top 0.254: R60.1 R61.2 62.23,62.8 62.23,64.01 61.59,64.64 60.96,64.64 60.45,65.15 60.45,71.37 60.89,71.82 Q19.1
N$136
  Top 0.254: R61.1 R63.2 64.2,67.88 63.25,68.83 63.25,70.48 62.87,70.87 Q19.2
N$137  (via drill 0.6)
  Top 0.254: R68.2 50.87,73.85 51.05,73.66 52.32,73.66 53.09,72.9 53.09,71.85 Q20.5 54.8,71.82 54.86,71.75 56.16,71.75 Q22.1 56.13,71.79 56.13,72.26 v55.12,73.28 | R65.1 61.85,75.38 v61.85,77.6
  Bottom 0.254: v55.12,73.28 59.44,77.6 v61.85,77.6
N$138
  Top 0.254: R68.1 54.74,75.31 54.86,75.18 56.33,75.18 R70.2 56.45,73.72 57.53,72.64 57.53,71.12 57.15,70.74 Q22.2
N$141
  Top 0.254: Q16.1 27.12,93.91 27.43,93.6 27.43,90.93 28.07,90.3 28.07,88.96 R44.1 | R44.1 28.13,87.69 27.69,87.25 27.18,87.25 26.92,87 D6.3 | R44.1 R52.2 R46.2
N$142
  Top 0.254: R46.1 R48.2 37.91,86.42 37.59,86.74 36.96,86.74 35.81,87.88 35.81,93.34 36.64,94.17 Q14.1
N$143
  Top 0.254: R48.1 R50.2 39.81,90.36 38.86,91.31 38.86,92.84 38.48,93.22 Q14.2
N$144  (via drill 0.6)
  Top 0.254: R56.2 26.36,95.69 26.92,95.12 28.57,95.12 28.83,94.87 28.83,94.01 Q16.5 Q18.1 31.47,94.64 v31.11,95 | v37.59,99.57 37.59,97.09 R54.1
  Bottom 0.254: v31.11,95 31.11,96.01 34.67,99.57 v37.59,99.57
N$145
  Top 0.254: Q18.2 32.26,92.96 32.77,93.47 32.77,95 31.88,95.89 31.88,96.97 R58.2 R56.1
N$148
  Top 0.254: Q15.1 66.84,98.81 67.69,98.81 68.07,98.42 68.07,95.5 67.12,94.55 R43.1 67.12,91.88 68.07,90.93 D5.3 68.24,90.17 70.23,90.17 70.74,89.66 R45.2 72.96,91.75 72.77,91.95 72.77,93.67 R51.2
N$149
  Top 0.254: R45.1 R47.2 78.61,89.86 78.61,90.68 78.11,91.19 77.47,91.19 76.58,92.08 76.58,98.04 77.28,98.74 Q13.1
N$150
  Top 0.254: R47.1 80.71,92.46 R49.2 80.45,94.3 79.5,95.25 79.5,97.41 79.12,97.79 Q13.2
N$151  (via drill 0.6)
  Top 0.254: R55.2 67,100.39 67.31,100.08 68.58,100.08 69.34,99.31 69.34,98.77 Q15.5 Q17.1 72.14,98.96 72.14,99.19 71.63,99.69 v71.25,99.69 | R53.1 v75.95,101.73
  Bottom 0.254: v71.25,99.69 73.28,101.73 v75.95,101.73
N$152
  Top 0.254: Q17.2 73.28,97.79 73.66,98.17 73.66,99.44 73.15,99.95 72.52,99.95 72.26,100.2 72.26,101.41 R57.2 69.02,101.47 R55.1
N$155
  Top 0.254: Q23.1 46.77,93.98 47.5,93.98 48.01,93.47 48.01,91.31 46.8,90.11 R62.1 46.86,88.33 46.86,86.61 47.37,86.11 D11.3 47.67,84.58 R66.2 R71.2
N$156
  Top 0.254: R66.1 58.23,84.58 R67.2 58.55,84.9 58.55,86.23 57.91,86.87 57.15,86.87 56.52,87.5 56.52,93.22 57.21,93.91 Q21.1
N$157
  Top 0.254: R67.1 R69.2 60.39,90.11 59.44,91.06 59.44,92.58 59.05,92.96 Q21.2
N$158  (via drill 0.6)
  Top 0.254: R73.2 47.12,97.09 47.12,95.89 47.62,95.38 48.9,95.38 49.31,94.97 Q23.5 49.43,94.04 Q24.1 52.07,94.14 52.07,94.87 v51.69,95.25 | v58.29,100.46 58.36,100.39 R72.1
  Bottom 0.254: v51.69,95.25 56.9,100.46 v58.29,100.46
N$159
  Top 0.254: R73.1 R74.2 52.83,96.84 52.83,95.76 53.47,95.12 53.47,93.6 52.96,93.09 Q24.2
N$174
  Top 0.254: R28.1 26.16,121.35 26.16,122.94 25.65,123.44 X7.9
N$175
  Top 0.254: X7.8 23.11,123.19 21.97,122.05 21.97,116.71 20.57,115.32 20.57,112.39 20.25,112.08 R25.1
N$176
  Top 0.254: X7.7 R24.1
N$177
  Top 0.254: X7.6 R23.1
N$178
  Top 0.254: X7.5 R20.1
QN_ALT  (via drill 0.6)
  Top 0.254: U1.9 4.21,94.74 v3.3,94.74 | v59.82,78.99 58.8,78.99 58.42,79.38 44.2,79.38 42.8,80.77 v25.91,80.77 | v68.83,76.45 69.85,76.45 v72.52,73.79
  Bottom 0.254: v3.3,94.74 17.91,80.14 24.89,80.14 25.53,80.77 v25.91,80.77 | v59.82,78.99 66.29,78.99 v68.83,76.45 | v72.52,73.79 72.52,55.12 77.47,50.16 80.44,50.16 X2.9
RCLK  (via drill 0.6)
  Top 0.254: U1.12 6.28,92.89 3.94,90.55 v3.94,89.28 | X1.6 23.62,57.88 24.86,56.64 54.48,56.64 54.86,56.26 v68.58,56.26 | v68.58,60.83 74.42,60.83 77.4,57.86 X2.6
  Bottom 0.254: v3.94,89.28 1.91,87.25 1.91,76.45 1.78,76.33 1.78,59.05 2.92,57.91 5.65,57.91 X1.6 | v68.58,56.26 v68.58,60.83
SER
  Top 0.254: U1.14 7.58,90.51 2.79,85.72 2.79,65.91 3.2,65.5 X1.3
SRCLK  (via drill 0.6)
  Top 0.254: U2.1 U2.2 12.35,102.39 v12.32,102.36 | v2.92,99.06 2.92,98.17 4.45,96.65 5.08,96.65 5.59,96.14 5.59,94.91 U1.11 5.63,93.26 2.16,89.79 2.16,64.01 3.2,62.96 X1.4 8.54,62.96 10.29,61.21 26.54,61.21 29.72,58.04 74.93,58.04 76.2,56.77 76.2,54.1 77.52,52.78 X2.8
  Bottom 0.254: v12.32,102.36 6.22,102.36 v2.92,99.06
SRCLR  (via drill 0.6)
  Top 0.254: U1.10 4.98,93.5 1.52,90.04 1.52,61.85 2.92,60.45 5.65,60.45 X1.5 26.42,60.42 29.56,57.28 69.72,57.28 70.48,56.52 v74.17,56.52
  Bottom 0.254: v74.17,56.52 75.36,55.32 X2.7
VDD  (via drill 0.6)
  Top 0.254: 18.29,94.93 C5.1 | 17.98,85.47 U3.1 17.98,92.79 18.35,93.16 C5.1 | 17.98,85.47 U3.20 20.43,83.2 22.73,80.9 23.62,80.9 27.18,77.34 27.18,74.3 26.29,73.41 14.99,73.41 14.1,74.3 14.1,75.31 13.46,75.95 9.91,75.95 | C5.1 18.41,95.06 18.41,96.65 | C4.1 19.49,105.35 20.07,104.78 20.07,103.17 U2.14 20.24,103 21.21,103 21.46,102.74 21.46,101.85 22.86,100.46 C3.1 24.2,99.12 24.64,98.68 24.64,96.14 23.62,95.12 22.23,95.12 20.95,96.39 18.67,96.39 18.41,96.65 | 17.98,85.47 18.03,85.47 18.8,84.71 20.77,84.71 C2.1 21.21,84.78 21.21,83.44 22.86,81.79 43.43,81.79 44.7,80.52 v58.29,80.52 | v68.2,80.52 75.44,73.28 80.01,73.28 80.93,74.2 R2.2 81.84,75.62 83.06,76.83 83.06,80.01 82.3,80.77 76.83,80.77 75.56,79.5 v75.56,76.58 | U1.16 8.89,94.85 8.89,93.6 v9.4,93.09 | v17.53,97.54 18.41,96.65 | R1.1 6.62,77.09 8.76,77.09 9.91,75.95 | 9.91,75.95 10.48,75.37 C1.1 10.48,72.08 9.02,70.61 5.71,70.61 X1.1
  Bottom 0.254: v58.29,80.52 v68.2,80.52 | v9.4,93.09 10.54,91.95 11.94,91.95 v17.53,97.54 | X2.11 77.52,45.16 76.96,45.72 76.96,47.24 70.99,53.21 70.99,74.42 73.15,76.58 v75.56,76.58

## Text on the board
tPlace: Indicator LEDS 1-8 | Green Galv 1-4 | Red Galv 1-4 | Red Galv 5-8 | Green Galv 5-8 | A Control Freaks product. October 13, 2016 | VDD | GLV_PB | GND | F_BATT | SER | GLV_SW | SRCLK | GLV_R | SRCLR | ARM_R | RCLK | DD_Relay_8-Shot_V4.0 | RCLK | ARM_R | SRCLR | GLV_R | GLV_SW | SRCLK | SER | GND | F_BATT | VDD | GLV_PB | CH4-B | CH4-A | CH3-B | CH3-A | CH2-B | CH2-A | CH1-B | CH1-A | CH8-B | CH8-A | CH7-B | CH1-A | CH7-A | CH6-B | CH6-A | CH5-B | CH5-A